# Altium schematic sheet Others.SchDoc
size A4
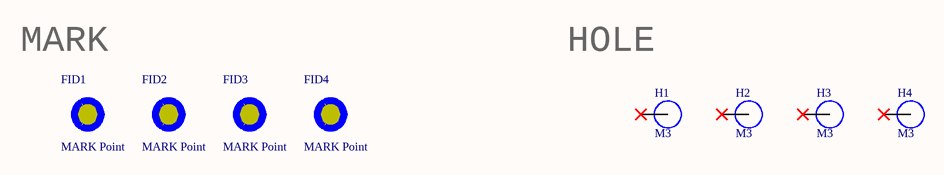
[diagram p0: Others.SchDoc]

## Parts
FID1  MARK Point  [FIDUCIAL]
FID2  MARK Point  [FIDUCIAL]
FID3  MARK Point  [FIDUCIAL]
FID4  MARK Point  [FIDUCIAL]
H1  M3  [M3_NPTH]
H2  M3  [M3_NPTH]
H3  M3  [M3_NPTH]
H4  M3  [M3_NPTH]

## Nets

Not connected (* = marked no-connect by the designer): H1 1*; H2 1*; H3 1*; H4 1*

## Notes on the sheet
- MARK
- HOLE

## Library data of the parts
FID1-FID4 = FIDUCIAL: 1mm Fiducial with 2mm soldermask, 3mm keepout
H1-H4 = NPTH: Hole without copper